# Altium schematic sheet Mainboard_Encoder Connector.SchDoc
size 381 x 254 mm
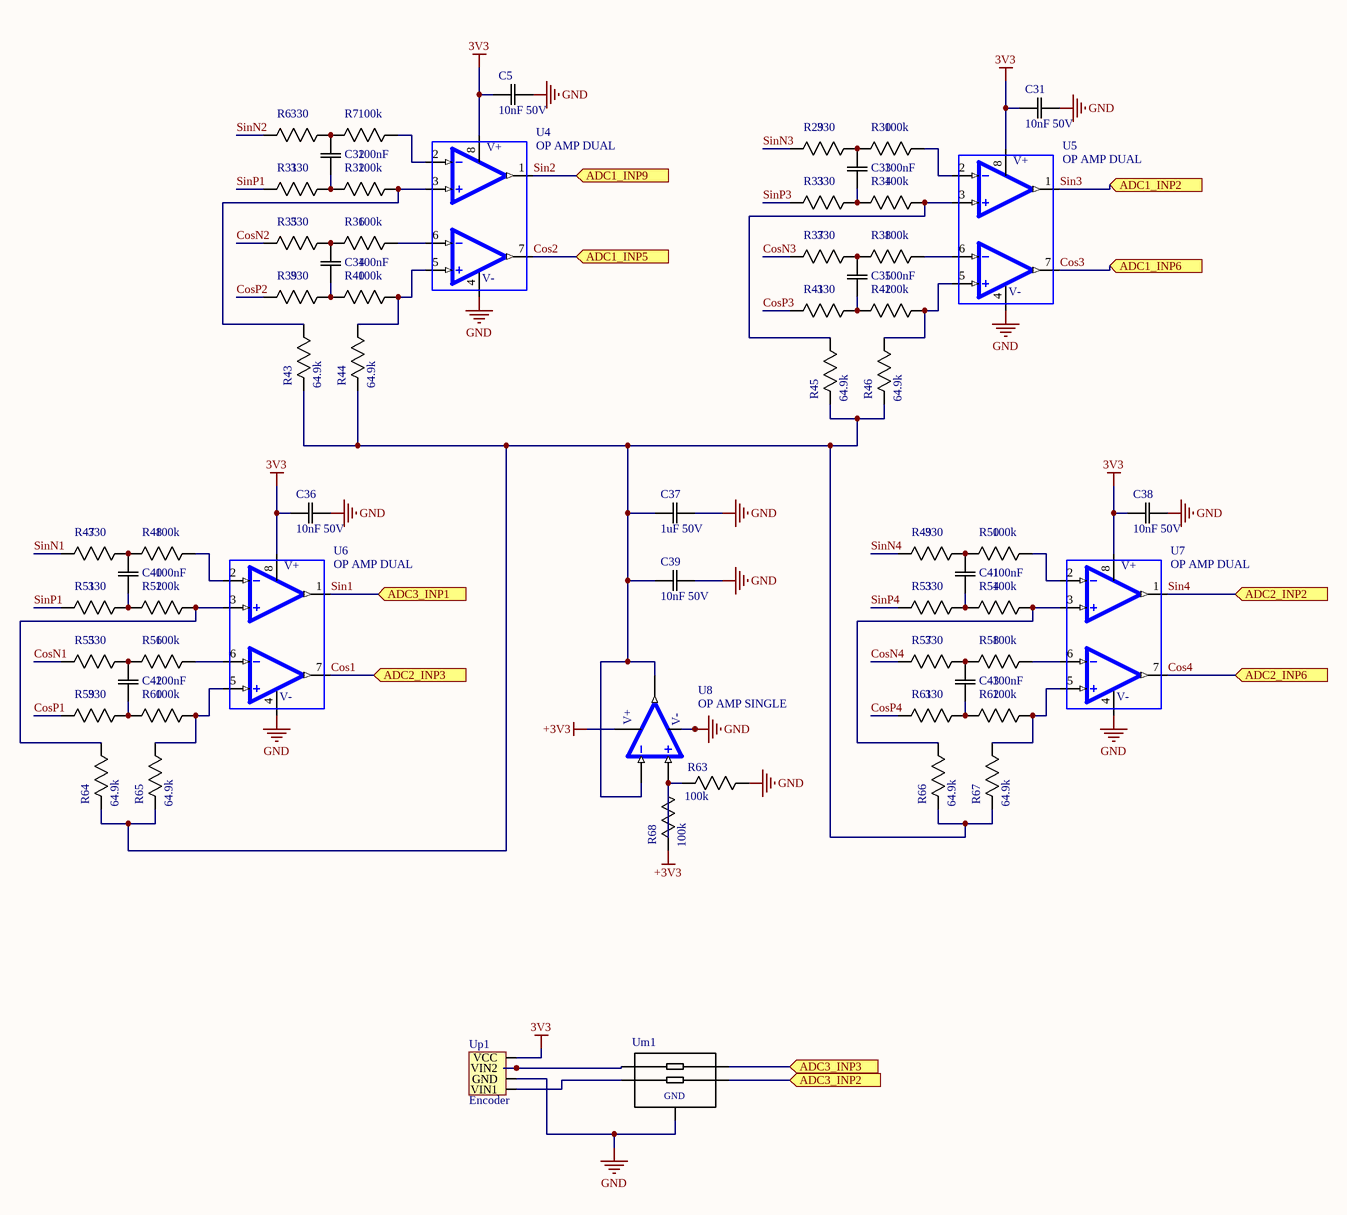
[diagram p0: Mainboard_Encoder Connector.SchDoc]

## Parts
C5  10nF 50V  [0805]
C31  10nF 50V  [0805]
C32  100nF
C33  100nF
C34  100nF
C35  100nF
C36  10nF 50V  [0805]
C37  1uF 50V  [0805]
C38  10nF 50V  [0805]
C39  10nF 50V  [0805]
C40  100nF
C41  100nF
C42  100nF
C43  100nF
R6  330  [0805]
R7  100k  [0805]
R29  330  [0805]
R30  100k  [0805]
R31  330  [0805]
R32  100k  [0805]
R33  330  [0805]
R34  100k  [0805]
R35  330  [0805]
R36  100k  [0805]
R37  330  [0805]
R38  100k  [0805]
R39  330  [0805]
R40  100k  [0805]
R41  330  [0805]
R42  100k  [0805]
R43  64.9k  [0805]
R44  64.9k  [0805]
R45  64.9k  [0805]
R46  64.9k  [0805]
R47  330  [0805]
R48  100k  [0805]
R49  330  [0805]
R50  100k  [0805]
R51  330  [0805]
R52  100k  [0805]
R53  330  [0805]
R54  100k  [0805]
R55  330  [0805]
R56  100k  [0805]
R57  330  [0805]
R58  100k  [0805]
R59  330  [0805]
R60  100k  [0805]
R61  330  [0805]
R62  100k  [0805]
R63  100k  [0805]
R64  64.9k  [0805]
R65  64.9k  [0805]
R66  64.9k  [0805]
R67  64.9k  [0805]
R68  100k  [0805]
U4  OP AMP DUAL  [8-MSOP]
U5  OP AMP DUAL  [8-MSOP]
U6  OP AMP DUAL  [8-MSOP]
U7  OP AMP DUAL  [8-MSOP]
U8  OP AMP SINGLE  [SOT95P280X145-5N]
Um1  EMI  [SOT-665]  (value not drawn)
Up1  Encoder  [EncoderConnector]

## Ports
ADC1_INP2 (in), ADC1_INP5 (in), ADC1_INP6 (in), ADC1_INP9 (in), ADC2_INP2 (in), ADC2_INP3 (in), ADC2_INP6 (in), ADC3_INP1 (in), ADC3_INP2 (in), ADC3_INP3 (in)

## Nets
3V3: C5.1(C1) C31.1(C1) C36.1(C1) C38.1(C1) U4.8(V+) U5.8(V+) U6.8(V+) U7.8(V+) Up1.VCC
+3V3: R68.2(R2) U8.5(V+)
GND: C5.2(C2) C31.2(C2) C36.2(C2) C37.2(C2) C38.2(C2) C39.2(C2) R63.1(R1) U4.4(V-) U5.4(V-) U6.4(V-) U7.4(V-) U8.2(V-) Um1.2(P$2) Up1.GND
ADC3_INP2: Um1.4(P$4) ; port ADC3_INP2
ADC3_INP3: Um1.5(P$5) ; port ADC3_INP3
Cos1: U6.7(OUTB) ; port ADC2_INP3
Cos2: U4.7(OUTB) ; port ADC1_INP5
Cos3: U5.7(OUTB) ; port ADC1_INP6
Cos4: U7.7(OUTB) ; port ADC2_INP6
CosN1: R55.2(R2)
CosN2: R35.2(R2)
CosN3: R37.2(R2)
CosN4: R57.2(R2)
CosP1: R59.2(R2)
CosP2: R39.2(R2)
CosP3: R41.2(R2)
CosP4: R61.2(R2)
Sin1: U6.1(OUTA) ; port ADC3_INP1
Sin2: U4.1(OUTA) ; port ADC1_INP9
Sin3: U5.1(OUTA) ; port ADC1_INP2
Sin4: U7.1(OUTA) ; port ADC2_INP2
SinN1: R47.2(R2)
SinN2: R6.2(R2)
SinN3: R29.2(R2)
SinN4: R49.2(R2)
SinP1: R31.2(R2) R51.2(R2)
SinP3: R33.2(R2)
SinP4: R53.2(R2)
NetC32_1: C32.1(C1) R31.1(R1) R32.2(R2)
NetC32_2: C32.2(C2) R6.1(R1) R7.2(R2)
NetC33_1: C33.1(C1) R33.1(R1) R34.2(R2)
NetC33_2: C33.2(C2) R29.1(R1) R30.2(R2)
NetC34_1: C34.1(C1) R39.1(R1) R40.2(R2)
NetC34_2: C34.2(C2) R35.1(R1) R36.2(R2)
NetC35_1: C35.1(C1) R41.1(R1) R42.2(R2)
NetC35_2: C35.2(C2) R37.1(R1) R38.2(R2)
NetC37_1: C37.1(C1) C39.1(C1) R43.2(R2) R44.2(R2) R45.2(R2) R46.2(R2) R64.2(R2) R65.2(R2) R66.2(R2) R67.2(R2) U8.1(OUT) U8.4(IN-)
NetC40_1: C40.1(C1) R51.1(R1) R52.2(R2)
NetC40_2: C40.2(C2) R47.1(R1) R48.2(R2)
NetC41_1: C41.1(C1) R53.1(R1) R54.2(R2)
NetC41_2: C41.2(C2) R49.1(R1) R50.2(R2)
NetC42_1: C42.1(C1) R59.1(R1) R60.2(R2)
NetC42_2: C42.2(C2) R55.1(R1) R56.2(R2)
NetC43_1: C43.1(C1) R61.1(R1) R62.2(R2)
NetC43_2: C43.2(C2) R57.1(R1) R58.2(R2)
NetR7_1: R7.1(R1) U4.2(INA-)
NetR30_1: R30.1(R1) U5.2(INA-)
NetR32_1: R32.1(R1) R43.1(R1) U4.3(INA+)
NetR34_1: R34.1(R1) R45.1(R1) U5.3(INA+)
NetR36_1: R36.1(R1) U4.6(INB-)
NetR38_1: R38.1(R1) U5.6(INB-)
NetR40_1: R40.1(R1) R44.1(R1) U4.5(INB+)
NetR42_1: R42.1(R1) R46.1(R1) U5.5(INB+)
NetR48_1: R48.1(R1) U6.2(INA-)
NetR50_1: R50.1(R1) U7.2(INA-)
NetR52_1: R52.1(R1) R64.1(R1) U6.3(INA+)
NetR54_1: R54.1(R1) R66.1(R1) U7.3(INA+)
NetR56_1: R56.1(R1) U6.6(INB-)
NetR58_1: R58.1(R1) U7.6(INB-)
NetR60_1: R60.1(R1) R65.1(R1) U6.5(INB+)
NetR62_1: R62.1(R1) R67.1(R1) U7.5(INB+)
NetR63_2: R63.2(R2) R68.1(R1) U8.3(IN+)
NetUm1_1: Um1.1(P$1) Up1.VIN2
NetUm1_3: Um1.3(P$3) Up1.VIN1

## Notes on the sheet
- (in symbol IP4256CZ5-W) GND

## Library data of the parts
C5 C31 C36 C38 C39 = CAP 10nF 50V: CAP CER 10000PF 50V X7R 0805; Tolerance: 10%; Package: 0805; Value: 10nF; Rating: 50V; Temperature Coefficient: X7R; Operating Temperature: -55°C ~ 125°C
C32-C35 C40-C43 = CAPACITOR_SCH
C37 = CAP 1uF 50V: CAP CER 1UF 50V X7R 0805; Tolerance: 10%; Package: 0805; Value: 1uF; Rating: 50V; Temperature Coefficient: X7R; Operating Temperature: -55°C ~ 125°C
R6 R29 R31 R33 R35 R37 R39 R41 R47 R49 R51 R53 R55 R57 R59 R61 = RES 330.0 1/8W - 1%: RES SMD 330 OHM 1% 1/8W 0805; Rating: 0.125W; Package: 0805; Value: 330; Tolerance: 1%
R7 R30 R32 R34 R36 R38 R40 R42 R48 R50 R52 R54 R56 R58 R60 R62 R63 R68 = RES 100k 1/8W - 1%: RES SMD 100K OHM 1% 1/8W 0805; Power (Watts): 0.125W; Package: 0805; Value: 100k; Tolerance: 1%
R43-R46 R64-R67 = RES 64.9k 1/8W: RES SMD 64.9K OHM 1% 1/8W 0805; Power (Watts): 0.125W; Package: 0805; Value: 64.9k; Tolerance: 1%; ComponentLink1Description: digikey; ComponentLink1URL: https://www.digikey.ca/en/products/detail/yageo/RC0805FR-0764K9L/728090
U4-U7 = OP AMP DUAL: IC OPAMP VFB 50KHZ RRO 8MSOP; Manufacturer: Analog Devices; Manufacturer Part Number: ADA4505-2ARMZ; Common Mode Rejection Ratio: 105dB; Max Supply Voltage: 5V; Min Supply Voltage: 1.8V; Max Dual Supply Voltage: 2.5V; Min Dual Supply Voltage: 900mV; Voltage Gain: 120dB; Operating Supply Voltage: 3V; Slew Rate: 0.006V/µs; Input Offset Voltage (Vos): 3mV; Input Bias Current: 0.5pA; Operating Supply Current: 14uA; Number of Channels: 2; Power Supply Rejection Ratio (PSRR): 110dB; Output Current per Channel: 40mA; Quiescent Current: 7uA; Input Capacitance: 4.7pF; Supply Type: Single,Dual; Supplier 1: Digi-Key; RoHS: Yes; Category: Amplifiers - Op Amps, Buffer, Instrumentation; Stock 1: 767; Case/Package: MSOP; Number of Pins: 8; Contact Plating: Tin,Matte; Min Operating Temperature: -40°C; Max Operating Temperature: 125°C; Gain Bandwidth Product: 50kHz; Packaging: Rail/Tube; Package Quantity: 50; Unity Gain Bandwidth Product: 50kHz; Number of Circuits: 2; Number of Elements: 2; Number of Amplifiers: 2; Max Input Voltage: 5V; Nominal Supply Current: 7uA; Bandwidth: 50kHz; Length: 3.2mm; Width: 3.2mm; Height: 0.95mm; Lead Free: Contains Lead; REACH SVHC: No SVHC; ComponentLink1URL: https://datasheet.ciiva.com/24017/ada4505-1-4505-2-4505-4-249280-24017665.pdf?src-supplier=Mouser; ComponentLink1Description: https://datasheet.ciiva.com/24017/ada4505-1-4505-2-4505-4-249280-24017665.pdf?src-supplier=Mouser; ComponentLink2URL: https://datasheet.ciiva.com/2974/ada4505-1-4505-2-4505-4-2974772.pdf?src-supplier=Avnet; ComponentLink2Description: https://datasheet.ciiva.com/2974/ada4505-1-4505-2-4505-4-2974772.pdf?src-supplier=Avnet; ComponentLink3URL: https://datasheet.ciiva.com/17569/ada4505-1-4505-2-4505-4-17569270.pdf?src-supplier=Avnet+Europe; ComponentLink3Description: https://datasheet.ciiva.com/17569/ada4505-1-4505-2-4505-4-17569270.pdf?src-supplier=Avnet+Europe; ComponentLink4URL: https://datasheet.ciiva.com/1805/ada4505-1-4505-2-4505-4-1805784.pdf?src-supplier=Digi-Key; ComponentLink4Description: https://datasheet.ciiva.com/1805/ada4505-1-4505-2-4505-4-1805784.pdf?src-supplier=Digi-Key; Supplier Part Number 1: ADA4505-2ARMZ-ND
U8 = OP AMP SINGLE: ANALOG DEVICES - ADA4505-1ARJZ-R7 - IC, AMPLIF. OPER., R-R, CMOS, SOT23-5; Min Supply Voltage: 1.8V; Max Supply Voltage: 5V; Min Dual Supply Voltage: 900mV; Max Dual Supply Voltage: 2.5V; Voltage Gain: 120dB; Common Mode Rejection Ratio: 105dB; Gain Bandwidth Product: 50kHz; Slew Rate: 0.006V/µs; Operating Supply Voltage: 3V; Number of Circuits: 1; Input Bias Current: 500nA; Input Offset Voltage (Vos): 3mV; Operating Supply Current: 9uA; Output Current per Channel: 40mA; Power Supply Rejection Ratio (PSRR): 110dB; Input Capacitance: 4.7pF; Supplier 1: Digi-Key; Manufacturer: Analog Devices; Manufacturer Part Number: ADA4505-1ARJZ-R7; RoHS: Yes; Category: Amplifiers - Op Amps, Buffer, Instrumentation; Stock 1: 3416; Case/Package: SOT-23-5; Number of Pins: 5; Contact Plating: Tin,Matte; Min Operating Temperature: -40°C; Max Operating Temperature: 125°C; Bandwidth: 50kHz; Packaging: Tape and Reel; Package Quantity: 3000; Unity Gain Bandwidth Product: 50kHz; Number of Channels: 1; Number of Elements: 1; Number of Amplifiers: 1; Quiescent Current: 9uA; REACH SVHC: No SVHC; Lead Free: Contains Lead; ComponentLink1URL: https://datasheet.ciiva.com/22712/1610797-22712032.pdf?src-supplier=Element14; ComponentLink1Description: https://datasheet.ciiva.com/22712/1610797-22712032.pdf?src-supplier=Element14; ComponentLink2URL: https://datasheet.ciiva.com/23805/608874-23805844.pdf?src-supplier=Newark; ComponentLink2Description: https://datasheet.ciiva.com/23805/608874-23805844.pdf?src-supplier=Newark; ComponentLink3URL: https://datasheet.ciiva.com/1487/1610797-1487372.pdf?src-supplier=Element14; ComponentLink3Description: https://datasheet.ciiva.com/1487/1610797-1487372.pdf?src-supplier=Element14; Supplier Part Number 1: ADA4505-1ARJZ-R7CT-ND
Um1 = IP4256CZ5-W: RC (Pi) EMI Filter 2nd Order Low Pass 2 Channel R = 100Ohms, C = 19pF (Total)  SOT-665; MF: Nexperia USA Inc.; MP: IP4256CZ5-W,115; SnapEDA_Link: https://www.snapeda.com/parts/IP4256CZ5-W/Nexperia%20USA%20Inc./view-part/3605439/?ref=snap; Price: 0.17 CAD; Package: SOT-665; Digikey: 1727-4718-1-ND; Digikey Link: https://www.digikey.ca/product-detail/en/nexperia-usa-inc/IP4256CZ5-W115/1727-4718-1-ND/2531158
Up1 = Encoder Connector: CONN HEADER R/A 4POS 1.5MM; MF: JST Sales America Inc.; MP: S4B-ZR(LF)(SN); Rating: 1A; Digikey: 455-1671-ND; Digikey Link: https://www.digikey.ca/products/en?keywords=455-1671-ND; Price: 0.324 CAD; Package: N/A; Value: N/A